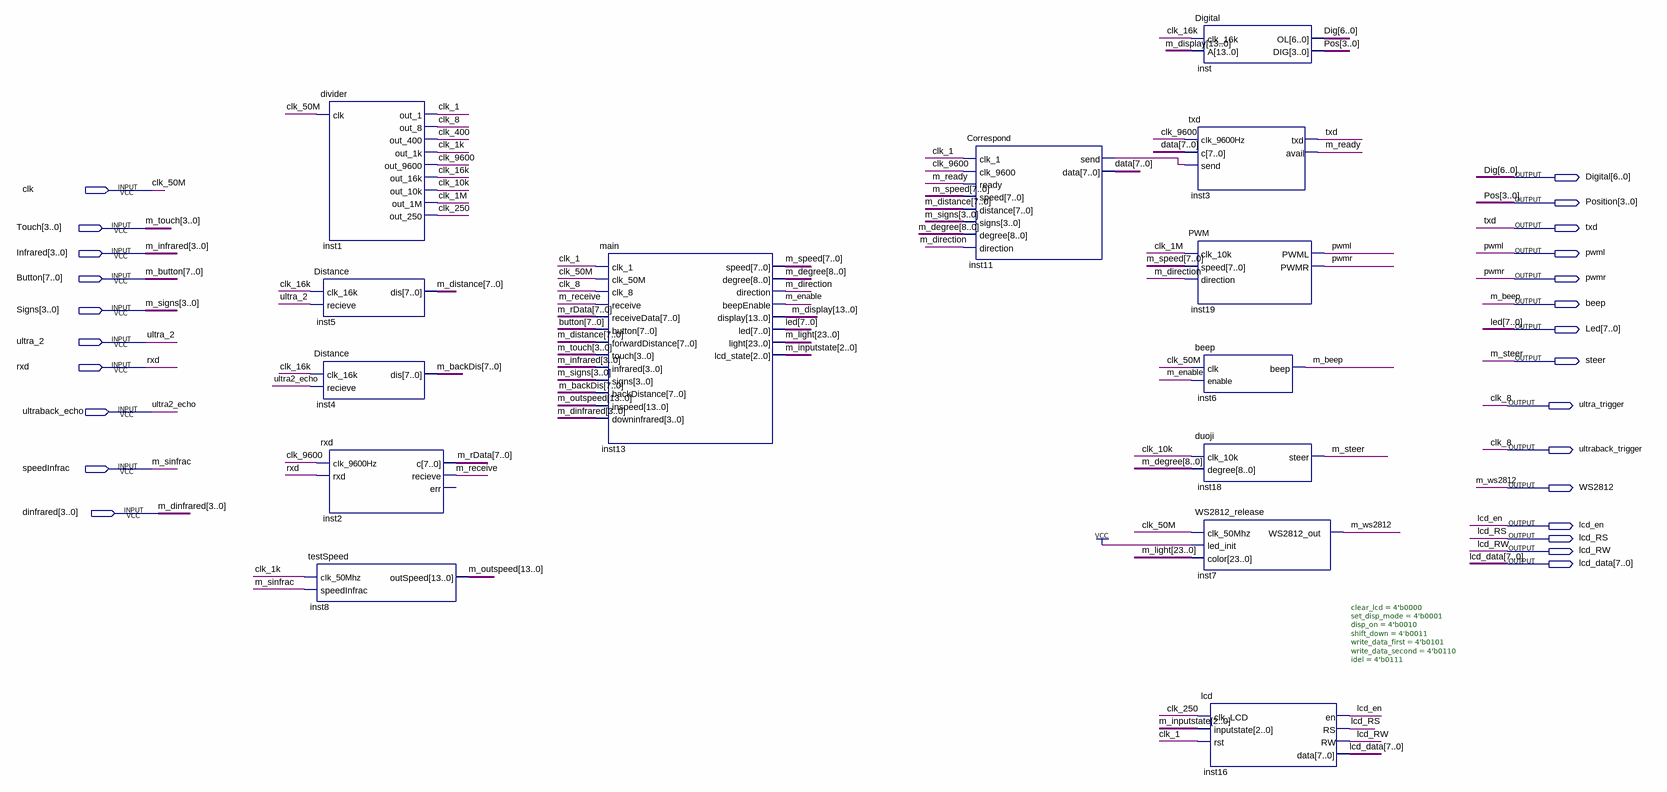
[diagram p0: schematic sheet]
// Quartus schematic top.bdf as structural Verilog: 14 symbols, 25 pins
module top (
  input  clk,
  input  [3:0] Touch,
  input  [3:0] Infrared,
  input  [7:0] Button,
  input  [3:0] Signs,
  input  ultra_2,
  input  rxd,
  input  ultraback_echo,
  input  speedInfrac,
  input  [3:0] dinfrared,
  output [6:0] Digital,
  output [3:0] Position,
  output txd,
  output pwml,
  output pwmr,
  output beep,
  output [7:0] Led,
  output steer,
  output ultra_trigger,
  output ultraback_trigger,
  output WS2812,
  output lcd_en,
  output lcd_RS,
  output lcd_RW,
  output [7:0] lcd_data
);

  wire clk_1, clk_1k, clk_1M, clk_10k, clk_16k, clk_250, clk_400, clk_9600, inst11_send, m_direction,
       m_enable, m_ready, m_receive;
  wire [2:0] m_inputstate;
  wire [7:0] data, m_backDis, m_distance, m_rData, m_speed;
  wire [8:0] m_degree;
  wire [13:0] m_display, m_outspeed;
  wire [23:0] m_light;

  divider inst1 (
    .clk(clk), .out_1(clk_1), .out_8(ultra_trigger), .out_400(clk_400), .out_1k(clk_1k), .out_9600(clk_9600),
    .out_16k(clk_16k), .out_10k(clk_10k), .out_1M(clk_1M), .out_250(clk_250));
  Distance inst5 (.clk_16k(clk_16k), .recieve(ultra_2), .dis(m_distance));
  Distance inst4 (.clk_16k(clk_16k), .recieve(ultraback_echo), .dis(m_backDis));
  rxd inst2 (.clk_9600Hz(clk_9600), .rxd(rxd), .c(m_rData), .recieve(m_receive));  // open: err
  testSpeed inst8 (.clk_50Mhz(clk_1k), .speedInfrac(speedInfrac), .outSpeed(m_outspeed));
  main inst13 (
    .clk_1(clk_1), .clk_50M(clk), .clk_8(ultra_trigger), .receive(m_receive), .receiveData(m_rData),
    .button(Button), .forwardDistance(m_distance), .touch(Touch), .infrared(Infrared), .signs(Signs),
    .backDistance(m_backDis), .inspeed(m_outspeed), .downinfrared(dinfrared), .speed(m_speed),
    .degree(m_degree), .direction(m_direction), .beepEnable(m_enable), .display(m_display), .led(Led),
    .light(m_light), .lcd_state(m_inputstate));
  Correspond inst11 (
    .clk_1(clk_1), .clk_9600(clk_9600), .ready(m_ready), .speed(m_speed), .distance(m_distance),
    .signs(Signs), .degree(m_degree), .direction(m_direction), .send(inst11_send), .data(data));
  txd inst3 (.clk_9600Hz(clk_9600), .c(data), .send(inst11_send), .txd(txd), .avail(m_ready));
  PWM inst19 (.clk_10k(clk_1M), .speed(m_speed), .direction(m_direction), .PWML(pwml), .PWMR(pwmr));
  Digital inst (.clk_16k(clk_16k), .A(m_display), .OL(Digital), .DIG(Position));
  beep inst6 (.clk(clk), .enable(m_enable), .beep(beep));
  duoji inst18 (.clk_10k(clk_10k), .degree(m_degree), .steer(steer));
  WS2812_release inst7 (.clk_50Mhz(clk), .led_init(1'b1), .color(m_light), .WS2812_out(WS2812));
  lcd #(.clear_lcd(4'b0000), .set_disp_mode(4'b0001), .disp_on(4'b0010), .shift_down(4'b0011), .write_data_first(4'b0101), .write_data_second(4'b0110), .idel(4'b0111)) inst16 (
    .clk_LCD(clk_250), .inputstate(m_inputstate), .rst(clk_1), .en(lcd_en), .RS(lcd_RS), .RW(lcd_RW),
    .data(lcd_data));

  assign ultraback_trigger = ultra_trigger;

  // Other names for the same wires on the sheet: clk_8 = ultra_trigger; clk_50M = clk; Dig[6:0] = Digital;
  //   m_beep = beep; m_button[7:0] = Button; m_dinfrared[3:0] = dinfrared; m_infrared[3:0] = Infrared;
  //   m_signs[3:0] = Signs; m_sinfrac = speedInfrac; m_steer = steer; m_touch[3:0] = Touch; m_ws2812 = WS2812;
  //   Pos[3:0] = Position; ultra2_echo = ultraback_echo
endmodule
